# Altium schematic sheet SPT10-V1.3.SCHDOC
size A4
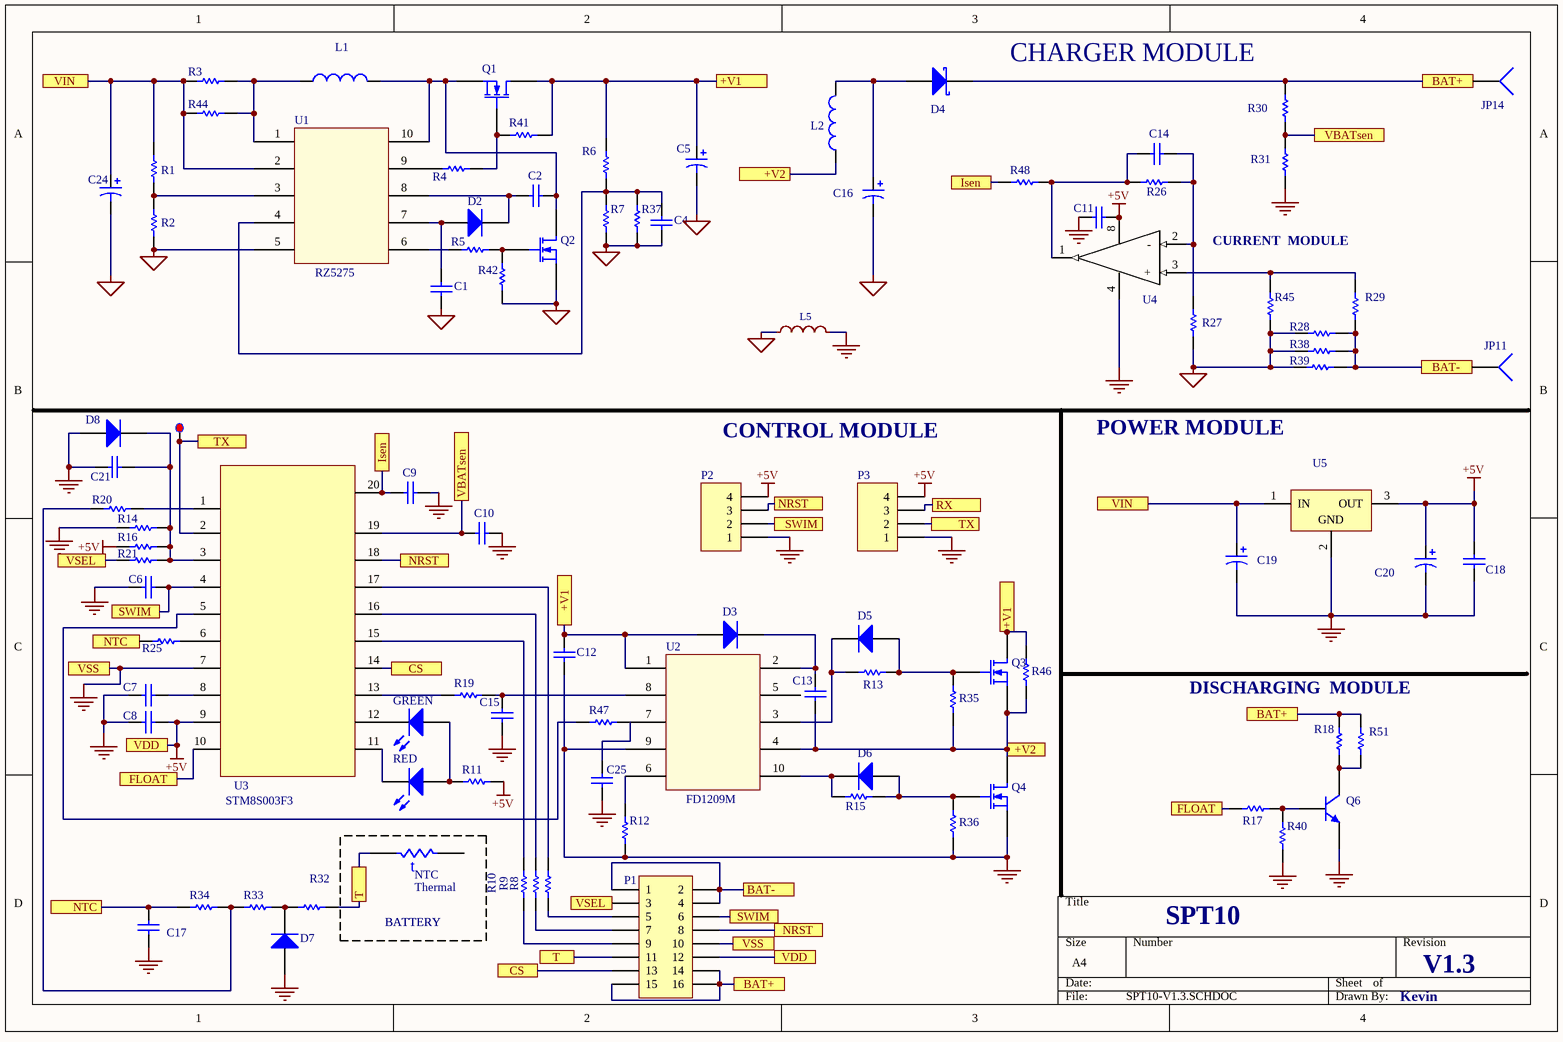
[diagram p0: SPT10-V1.3.SCHDOC]

## Parts
*  *  (value not drawn)
C1  (no value)  [1206]
C2  104  [1206]  (value not drawn)
C4  (no value)  [1206]
C5  (no value)  [10*10.5]
C6  (no value)  [1206]
C7  (no value)  [1206]
C8  (no value)  [1206]
C9  (no value)  [1206]
C10  (no value)  [1206]
C11  (no value)  [1206]
C12  (no value)  [1206]
C13  (no value)  [1206]
C14  (no value)  [1206]
C15  (no value)  [1206]
C16  (no value)  [10*10.5]
C17  (no value)  [1206]
C18  (no value)  [RAD-0.3]
C19  (no value)  [RB7.6-15]
C20  (no value)  [RB7.6-15]
C21  (no value)  [1206]
C24  (no value)  [10*10.5]
C25  (no value)  [1206]
D2  (no value)  [LL34]
D3  (no value)  [SOD-123]
D4  (no value)  [1N5822]
D5  (no value)  [SOD-123]
D6  (no value)  [SOD-123]
D7  (no value)  [SOD-123]
D8  (no value)  [SOD-123]
GREEN  (no value)  [LED-2]
JP11  Socket  [PIN1]  (value not drawn)
JP14  Socket  [PIN1]  (value not drawn)
L1  (no value)  [L(SMD)]
L2  (no value)  [L(SMD)]
L5  3.3nH  [L0805]  (value not drawn)
NTC  Thermal  [6-0805]
P1  Header 8X2  [HDR2X8]  (value not drawn)
P2  Header 4  [HDR1X4]  (value not drawn)
P3  Header 4  [HDR1X4]  (value not drawn)
Q1  (no value)  [SOP-8]
Q2  (no value)  [SOP8-P]
Q3  MOSFET-N  [SOP8-P]  (value not drawn)
Q4  MOSFET-N  [SOP8-P]  (value not drawn)
Q6  (no value)  [SOT-23]
R1  (no value)  [1206]
R2  (no value)  [1206]
R3  (no value)  [1206]
R4  (no value)  [1206]
R5  (no value)  [1206]
R6  (no value)  [1206]
R7  (no value)  [1206]
R8  (no value)  [1206]
R9  (no value)  [1206]
R10  (no value)  [1206]
R11  (no value)  [1206]
R12  (no value)  [1206]
R13  (no value)  [1206]
R14  (no value)  [1206]
R15  (no value)  [1206]
R16  (no value)  [1206]
R17  (no value)  [1206]
R18  (no value)  [1206]
R19  (no value)  [1206]
R20  (no value)  [1206]
R21  (no value)  [1206]
R25  (no value)  [1206]
R26  (no value)  [1206]
R27  (no value)  [1206]
R28  (no value)  [1206]
R29  (no value)  [1206]
R30  (no value)  [1206]
R31  (no value)  [1206]
R32  (no value)  [1206]
R33  (no value)  [1206]
R34  (no value)  [1206]
R35  (no value)  [1206]
R36  (no value)  [1206]
R37  (no value)  [1206]
R38  (no value)  [1206]
R39  (no value)  [1206]
R40  (no value)  [1206]
R41  (no value)  [1206]
R42  (no value)  [1206]
R44  (no value)  [1206]
R45  (no value)  [1206]
R46  (no value)  [1206]
R47  (no value)  [1206]
R48  (no value)  [1206]
R51  (no value)  [1206]
RED  (no value)  [LED-2]
U1  RZ5275  [MS10]
U2  FD1209M  [MS10]
U3  STM8S003F3  [SSOP-20]
U4  (no value)  [SOP-8]
U5  (no value)  [T03B]

## Ports
+V1, +V2, BAT+, BAT-, CS, FLOAT, Isen, NRST, NTC, RX, SWIM, T, TX, VBATsen, VDD, VIN, VSEL, VSS

## Nets
+5V: C8.1 C11.1 C18.2 C20.1 P1.12 P2.4 P3.4 R11.2 R16.1 U3.9(VDD) U4.8 U5.3(OUT) ; port VDD
GND: C1.2 C4.2 C5.2 C6.2 C7.2 C8.2 C9.2 C10.1 C11.2 C12.2 C15.2 C16.2 C17.1 C18.1 C19.2 C20.2 C21.1 C24.2 C25.2 D7.1(A) D8.1(A) L5.1 L5.2 P1.10 P2.1 P3.1 Q2.3(S) Q4.3(S) Q6.3(E) R2.1 R7.2 R12.1 R14.1 R27.2 R28.1 R31.2 R36.1 R37.2 R38.1 R39.1 R40.1 R42.1 R45.1 U1.5(GND) U2.9(COM) U3.7(VSS) U4.4 U5.2(GND) ; port VSS
+V1: C5.1 C12.1 D3.1(A) Q1.3(D) Q3.1(D) R6.1 R41.2 R46.2 U2.1(VCC) ; port +V1
+V2: C13.2 L2.1 Q3.3(S) Q4.1(D) R35.1 R46.1 U2.4(VS) ; port +V2
BAT+: D4.1(K) JP14.1 P1.14 P1.15 P1.16 R18.1 R30.1 R51.1 ; port BAT+
BAT-: JP11.1 P1.1 P1.2 P1.4 R28.2 R29.2 R38.2 R39.2 ; port BAT-
CS: P1.13 U3.14(T_TERMINAL) ; port CS
FLOAT: R17.1 U3.10(FLOAT) ; port FLOAT
Isen: C9.1 R48.1 U3.20(CURRENT_SENSE) ; port Isen
NRST: P1.8 P2.3 U3.18(PD1/NRST) ; port NRST
NTC: C17.2 R25.2 R34.2 ; port NTC
RX: P3.3 ; port RX
SWIM: C6.1 P1.6 P2.2 U3.4(SWIM) ; port SWIM
T: NTC.1 P1.11 R32.1 ; port T
TX: *.11 P3.2 U3.2(PD5/TX) ; port TX
VBATsen: C10.2 R30.2 R31.1 U3.19(VOLT_SENSE) ; port VBATsen
VIN: C19.1 C24.1 R1.2 R3.1 R44.1 U1.2(VCC) U5.1(IN) ; port VIN
VSEL: P1.3 R21.2 ; port VSEL
NetC1_1: C1.1 D2.1(A) U1.7(VREF)
NetC2_1: C2.1 L1.2 Q1.1(S) Q2.1(D) U1.10(O_I)
NetC2_2: C2.2 D2.2(K) U1.8(O_O)
NetC4_1: C4.1 R6.2 R7.1 R37.1 U1.4(VRC)
NetC7_1: C7.1 U3.8(VCAP)
NetC13_1: C13.1 D3.2(K) U2.2(VB)
NetC14_1: C14.1 R26.2 R27.1 U4.2(-)
NetC14_2: C14.2 R26.1 R48.2 U4.1
NetC15_1: C15.1 R19.1 U2.8(IN)
NetC16_1: C16.1 D4.3(A) L2.2
NetC21_2: C21.2 D8.2(K) R14.2 R16.2 R21.1 U3.3(PD6/RX)
NetC25_1: C25.1 R47.1
NetD5_1: D5.1(A) Q3.2(G) R13.2 R35.2
NetD5_2: D5.2(K) R13.1 U2.3(HO)
NetD6_1: D6.1(A) Q4.2(G) R15.2 R36.2
NetD6_2: D6.2(K) R15.1 U2.10(LO)
NetD7_2: D7.2(K) R32.2 R33.2
NetGREEN_1: GREEN.1(A) R11.1 RED.1(A)
NetGREEN_2: GREEN.2(K) U3.12(PB4)
NetL1_1: L1.1 R3.2 R44.2 U1.1(SEN)
NetP1_5: P1.5 R8.2
NetP1_7: P1.7 R9.1
NetP1_9: P1.9 R10.1
NetQ1_2: Q1.2(G) R4.1 R41.1
NetQ2_2: Q2.2(G) R5.1 R42.2
NetQ6_1: Q6.1(C) R18.2 R51.2
NetQ6_2: Q6.2(B) R17.2 R40.2
NetR1_1: R1.1 R2.2 U1.3(EN)
NetR4_2: R4.2 U1.9(PH)
NetR5_2: R5.2 U1.6(PL)
NetR8_1: R8.1 U3.17(SPI_MISO)
NetR9_2: R9.2 U3.16(SPI_MOSI)
NetR10_2: R10.2 U3.15(SPI_SCK)
NetR12_2: R12.2 U2.6(RDT)
NetR19_2: R19.2 U3.13(PWM)
NetR20_1: R20.1 R33.1 R34.1
NetR20_2: R20.2 U3.1(NTC_CONTROL)
NetR25_1: R25.1 U3.6(PA2)
NetR29_1: R29.1 R45.2 U4.3(+)
NetR47_2: R47.2 U3.5(GD_ENABLE)
NetRED_2: RED.2(K) U3.11(PB5)

Not connected (* = marked no-connect by the designer): NTC 2; U2 5(NC) 7(EN)

## Notes on the sheet
- CHARGER MODULE
- CURRENT  MODULE
- CONTROL MODULE
- POWER MODULE
- DISCHARGING  MODULE
- BATTERY
- SPT10
- V1.3
- Kevin
- (in symbol Res Thermal) t

## Library data of the parts
* = PAD
C1 C2 C4 C6-C15 C17 C18 C21 C25 = Cap: Capacitor; Published: 8-Jun-2000; LatestRevisionDate: 17-Jul-2002; LatestRevisionNote: Re-released for DXP Platform.; PackageReference: RAD-0.3; Publisher: Altium Limited
C5 C16 C19 C20 C24 = Cap Pol1: Polarized Capacitor (Radial); Published: 8-Jun-2000; LatestRevisionDate: 17-Jul-2002; LatestRevisionNote: Re-released for DXP Platform.; PackageReference: RB7.6-15; Publisher: Altium Limited
D2 D3 D5-D8 = Diode 1N914: High Conductance Fast Diode; Published: 8-Jun-2000; LatestRevisionDate: 17-Jul-2002; LatestRevisionNote: Re-released for DXP Platform.; DatasheetDocument: 1997; PackageReference: DO-35; Publisher: Altium Limited; Code_JEDEC: DO-204-AH; ComponentLink1Description: Manufacturer Link; ComponentLink1URL: http://www.fairchildsemi.com/; ComponentLink2Description: Datasheet; ComponentLink2URL: http://www.fairchildsemi.com/ds/1N%2F1N4448.pdf
D4 = Diode 10TQ040: Schottky Rectifier; Note: Terminal 2 is the TAB and is electrically connected to the cathode; Published: 8-Jun-2000; LatestRevisionDate: 17-Jul-2002; LatestRevisionNote: Re-released for DXP Platform.; DatasheetDocument: PD-2.057B; PackageDocument: Feb-1998; PackageReference: TO-220AC; Publisher: Altium Limited; ComponentLink1Description: Manufacturer Link; ComponentLink1URL: http://www.irf.com/
GREEN RED = LED0: Typical INFRARED GaAs LED; Published: 8-Jun-2000; LatestRevisionDate: 08-Jul-2005; LatestRevisionNote: Mech Layer 1 removed.; PackageReference: LED-0; Publisher: Altium Limited
L1 L2 = Inductor: Code_IEC: 1005; Value: 10mH; Published: 8-Jun-2000; LatestRevisionDate: 17-Jul-2002; LatestRevisionNote: Re-released for DXP Platform.; PackageReference: 0402-A; Publisher: Altium Limited; Code_JEITA: 0402
L5 = 3.3nH: BOM_Manufacturer: Shenzhen Zhenhua Fu Elec; BOM_Manufacturer Part: CH2012H3N3S(f); nameAlias: Inductance; Contributor: LCSC; BOM_Supplier: LCSC; BOM_Supplier Part: C316293; spicePre: L; spiceSymbolName: CH2012H3N3S(F)
NTC = Res Thermal: Thermistor; Published: 24-Mar-1999; LatestRevisionDate: 04-Mar-2005; LatestRevisionNote: PCB Footprint replaced.; PackageReference: 6-0805; Publisher: Altium Limited
P1 = Header 8X2: Header, 8-Pin, Dual row; LatestRevisionDate: 17-Jul-2002; LatestRevisionNote: Re-released for DXP Platform.; Publisher: Altium Limited
P2 P3 = Header 4: Header, 4-Pin; LatestRevisionDate: 17-Jul-2002; LatestRevisionNote: Re-released for DXP Platform.; Publisher: Altium Limited
Q1-Q4 = MOSFET-N: N-Channel MOSFET; PackageDocument: 1995/1996; Published: 8-Jun-2000; LatestRevisionDate: 17-Jul-2002; LatestRevisionNote: Re-released for DXP Platform.; PackageReference: E3; Publisher: Altium Limited
Q6 = NPN: NPN Bipolar Transistor; Published: 8-Jun-2000; LatestRevisionDate: 17-Jul-2002; LatestRevisionNote: Re-released for DXP Platform.; PackageReference: TO-226; Publisher: Altium Limited; Code_JEDEC: TO-226-AA
R1-R21 R25-R42 R44-R48 R51 = Res1: Resistor; Value: 1K; Published: 8-Jun-2000; LatestRevisionDate: 17-Jul-2002; LatestRevisionNote: Re-released for DXP Platform.; PackageReference: AXIAL-0.3; Publisher: Altium Limited
U1 U2 = FD2204M
U3 = S3C9454
U4 = LMV321
U5 = LM7805CT: Series 3-Terminal Positive Regulator; Note: Tab is connected to GND; Published: 15-Apr-2002; DatasheetVersion: May-1999; PackageVersion: 1995; PackageReference: T03B; Publisher: Altium Limited; PackageDescription: TO, Thru-Hole, Vertical, Heatsink Mounted; 3 In-Line Leads; Pitch 2.54 mm; ComponentLink1Description: Manufacturer Link; ComponentLink1URL: http://www.national.com/; ComponentLink2Description: Datasheet; ComponentLink2URL: http://www.national.com/ds.cgi/LM/LM7512C.pdf; ComponentLink3Description: URL Link1; ComponentLink3URL: http://www.national.com/pf/LM/LM7805C.html
JP11 JP14 = Socket: LatestRevisionDate: 17-Jul-2002; LatestRevisionNote: Re-released for DXP Platform.; Publisher: Altium Limited